# Altium project PCB_Project.PrjPcb (part 3 of 11)
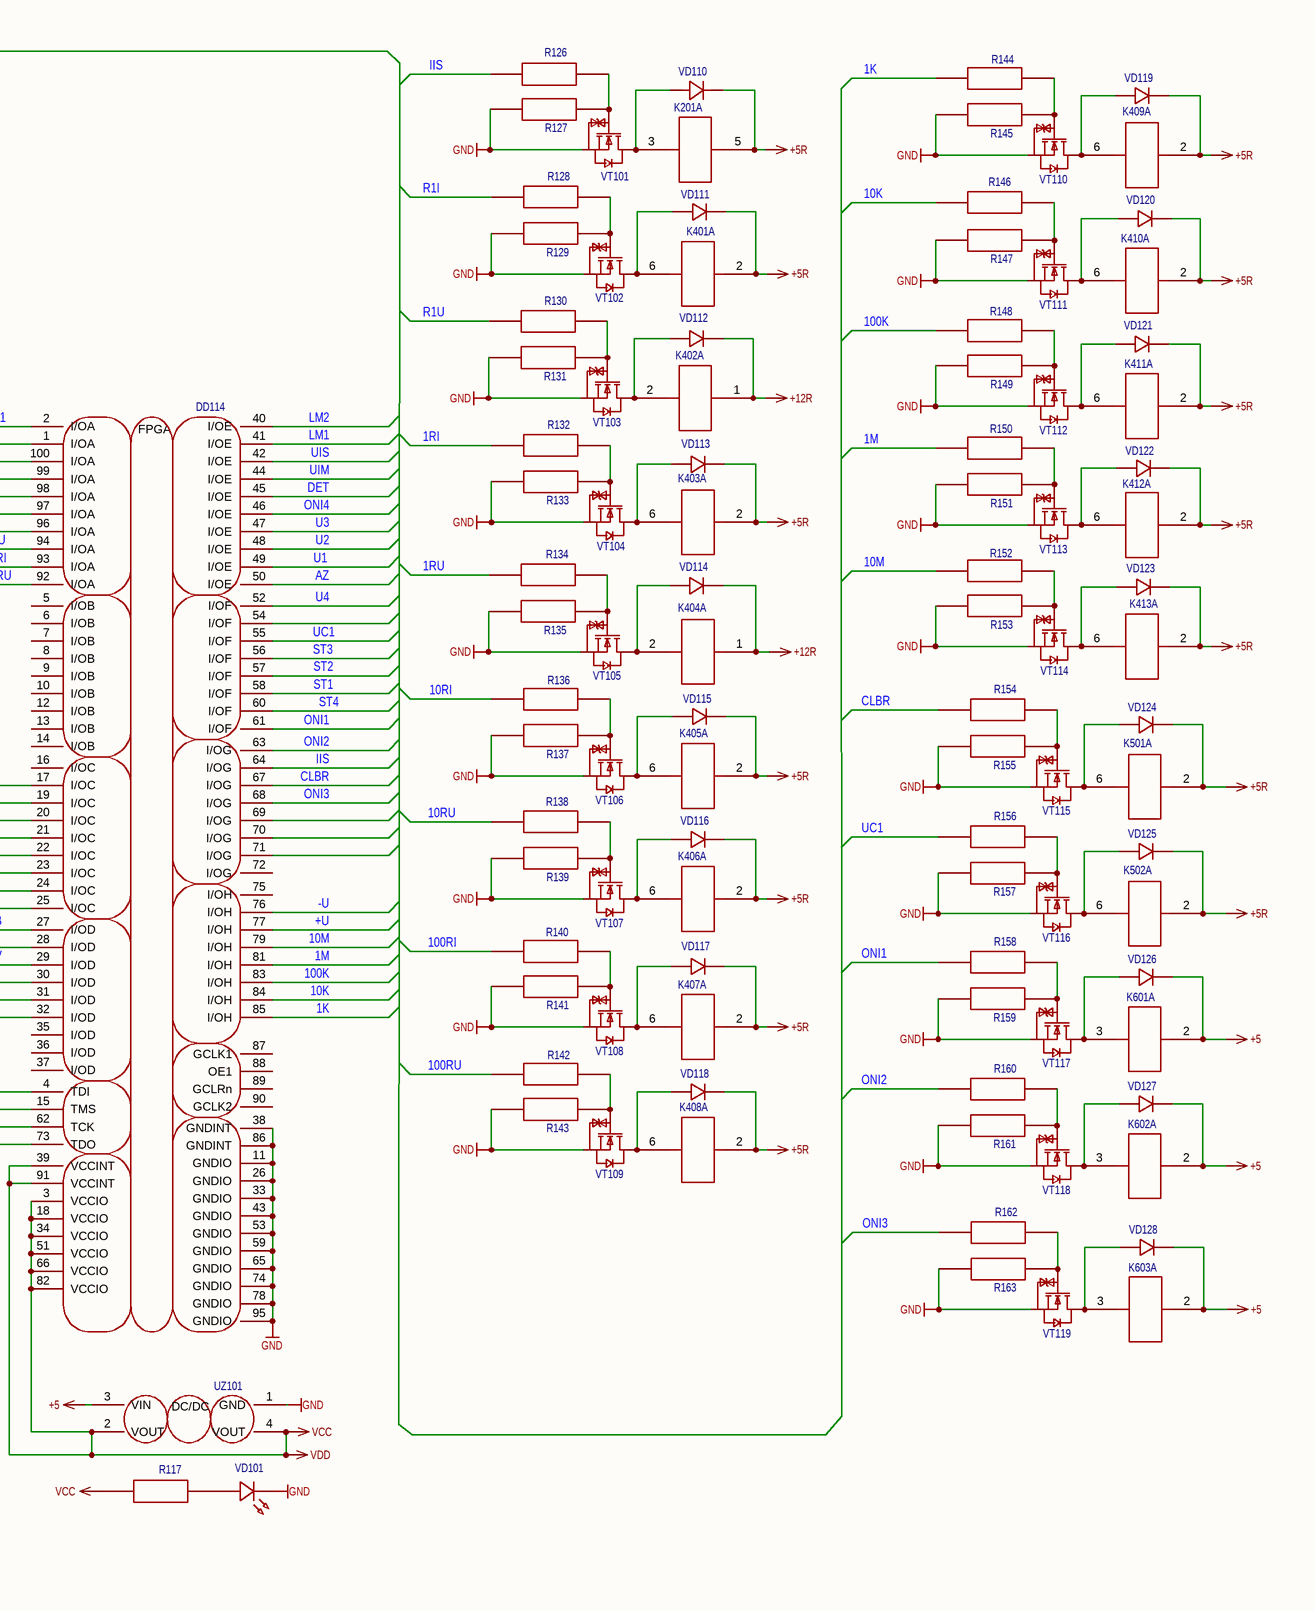
[diagram p9: УШЯИ.411618.029Э Э3 Лист 1.schdoc, right]

## Sheet УШЯИ.411618.029Э Э3 Лист 1.schdoc (continued)

### Library data of the parts (continued)
R143 = Резистор 100Ом 0,125Вт 1% [0805]: Contributor: jordanjin; Convert to PCB: yes; UniqueId: gge284a2cddc6cc5500; ModelId: de27d504f5024d53a3020ec2611f5e5e; Origin Footprint: R0805; Device: Резистор 100Ом 0,125Вт 1% [0805]; Symbol: Резистор 100Ом 0,125Вт 1% [0805]; Manufacturer Part: R0805; spicePre: R; spiceSymbolName: Резистор 12кОм 0,125Вт 1% [0805]; Add into BOM: yes; FootprintName: R0805; ModelName: R0805
R144 = Резистор 100Ом 0,125Вт 1% [DIP]: Origin Footprint: R0.125W; Contributor: jordanjin; Convert to PCB: yes; UniqueId: ggeaa410eb8306d9a98; Device: Резистор 100Ом 0,125Вт 1% [DIP]; Symbol: Резистор 100Ом 0,125Вт 1% [DIP]; Manufacturer Part: R0805; spicePre: R; spiceSymbolName: Резистор 100Ом 0,125Вт 1% [DIP]; Add into BOM: yes
R145 = Резистор 100Ом 0,125Вт 1% [0805]: Contributor: jordanjin; Convert to PCB: yes; UniqueId: gge17e49b262f8c481a; ModelId: de27d504f5024d53a3020ec2611f5e5e; Origin Footprint: R0805; Device: Резистор 100Ом 0,125Вт 1% [0805]; Symbol: Резистор 100Ом 0,125Вт 1% [0805]; Manufacturer Part: R0805; spicePre: R; spiceSymbolName: Резистор 12кОм 0,125Вт 1% [0805]; Add into BOM: yes; FootprintName: R0805; ModelName: R0805
R146 = Резистор 100Ом 0,125Вт 1% [DIP]: Origin Footprint: R0.125W; Contributor: jordanjin; Convert to PCB: yes; UniqueId: gge6c0c4eb072c61abf; Device: Резистор 100Ом 0,125Вт 1% [DIP]; Symbol: Резистор 100Ом 0,125Вт 1% [DIP]; Manufacturer Part: R0805; spicePre: R; spiceSymbolName: Резистор 100Ом 0,125Вт 1% [DIP]; Add into BOM: yes
R147 = Резистор 100Ом 0,125Вт 1% [0805]: Contributor: jordanjin; Convert to PCB: yes; UniqueId: ggeb272b0e92569094a; ModelId: de27d504f5024d53a3020ec2611f5e5e; Origin Footprint: R0805; Device: Резистор 100Ом 0,125Вт 1% [0805]; Symbol: Резистор 100Ом 0,125Вт 1% [0805]; Manufacturer Part: R0805; spicePre: R; spiceSymbolName: Резистор 12кОм 0,125Вт 1% [0805]; Add into BOM: yes; FootprintName: R0805; ModelName: R0805
R148 = Резистор 100Ом 0,125Вт 1% [DIP]: Origin Footprint: R0.125W; Contributor: jordanjin; Convert to PCB: yes; UniqueId: ggefae903f526e3c9e3; Device: Резистор 100Ом 0,125Вт 1% [DIP]; Symbol: Резистор 100Ом 0,125Вт 1% [DIP]; Manufacturer Part: R0805; spicePre: R; spiceSymbolName: Резистор 100Ом 0,125Вт 1% [DIP]; Add into BOM: yes
R149 = Резистор 100Ом 0,125Вт 1% [0805]: Contributor: jordanjin; Convert to PCB: yes; UniqueId: gge3dbaf11969537092; ModelId: de27d504f5024d53a3020ec2611f5e5e; Origin Footprint: R0805; Device: Резистор 100Ом 0,125Вт 1% [0805]; Symbol: Резистор 100Ом 0,125Вт 1% [0805]; Manufacturer Part: R0805; spicePre: R; spiceSymbolName: Резистор 12кОм 0,125Вт 1% [0805]; Add into BOM: yes; FootprintName: R0805; ModelName: R0805
R150 = Резистор 100Ом 0,125Вт 1% [DIP]: Origin Footprint: R0.125W; Contributor: jordanjin; Convert to PCB: yes; UniqueId: gge380871a5e186252d; Device: Резистор 100Ом 0,125Вт 1% [DIP]; Symbol: Резистор 100Ом 0,125Вт 1% [DIP]; Manufacturer Part: R0805; spicePre: R; spiceSymbolName: Резистор 100Ом 0,125Вт 1% [DIP]; Add into BOM: yes
R151 = Резистор 100Ом 0,125Вт 1% [0805]: Contributor: jordanjin; Convert to PCB: yes; UniqueId: gge063679ac9d12fccf; ModelId: de27d504f5024d53a3020ec2611f5e5e; Origin Footprint: R0805; Device: Резистор 100Ом 0,125Вт 1% [0805]; Symbol: Резистор 100Ом 0,125Вт 1% [0805]; Manufacturer Part: R0805; spicePre: R; spiceSymbolName: Резистор 12кОм 0,125Вт 1% [0805]; Add into BOM: yes; FootprintName: R0805; ModelName: R0805
R152 = Резистор 100Ом 0,125Вт 1% [DIP]: Origin Footprint: R0.125W; Contributor: jordanjin; Convert to PCB: yes; UniqueId: gge124f740b155750b2; Device: Резистор 100Ом 0,125Вт 1% [DIP]; Symbol: Резистор 100Ом 0,125Вт 1% [DIP]; Manufacturer Part: R0805; spicePre: R; spiceSymbolName: Резистор 100Ом 0,125Вт 1% [DIP]; Add into BOM: yes
R153 = Резистор 100Ом 0,125Вт 1% [0805]: Contributor: jordanjin; Convert to PCB: yes; UniqueId: gge27cee84ce076b68f; ModelId: de27d504f5024d53a3020ec2611f5e5e; Origin Footprint: R0805; Device: Резистор 100Ом 0,125Вт 1% [0805]; Symbol: Резистор 100Ом 0,125Вт 1% [0805]; Manufacturer Part: R0805; spicePre: R; spiceSymbolName: Резистор 12кОм 0,125Вт 1% [0805]; Add into BOM: yes; FootprintName: R0805; ModelName: R0805
R154 = Резистор 100Ом 0,125Вт 1% [DIP]: Origin Footprint: R0.125W; Contributor: jordanjin; Convert to PCB: yes; UniqueId: gge2e28954fc8669dd0; Device: Резистор 100Ом 0,125Вт 1% [DIP]; Symbol: Резистор 100Ом 0,125Вт 1% [DIP]; Manufacturer Part: R0805; spicePre: R; spiceSymbolName: Резистор 100Ом 0,125Вт 1% [DIP]; Add into BOM: yes
R155 = Резистор 100Ом 0,125Вт 1% [0805]: Contributor: jordanjin; Convert to PCB: yes; UniqueId: ggef886a17660e3a033; ModelId: de27d504f5024d53a3020ec2611f5e5e; Origin Footprint: R0805; Device: Резистор 100Ом 0,125Вт 1% [0805]; Symbol: Резистор 100Ом 0,125Вт 1% [0805]; Manufacturer Part: R0805; spicePre: R; spiceSymbolName: Резистор 12кОм 0,125Вт 1% [0805]; Add into BOM: yes; FootprintName: R0805; ModelName: R0805
R156 = Резистор 100Ом 0,125Вт 1% [DIP]: Origin Footprint: R0.125W; Contributor: jordanjin; Convert to PCB: yes; UniqueId: gge3cc4b2cca3c10891; Device: Резистор 100Ом 0,125Вт 1% [DIP]; Symbol: Резистор 100Ом 0,125Вт 1% [DIP]; Manufacturer Part: R0805; spicePre: R; spiceSymbolName: Резистор 100Ом 0,125Вт 1% [DIP]; Add into BOM: yes
R157 = Резистор 100Ом 0,125Вт 1% [0805]: Contributor: jordanjin; Convert to PCB: yes; UniqueId: gge7376950e8c8d98c9; ModelId: de27d504f5024d53a3020ec2611f5e5e; Origin Footprint: R0805; Device: Резистор 100Ом 0,125Вт 1% [0805]; Symbol: Резистор 100Ом 0,125Вт 1% [0805]; Manufacturer Part: R0805; spicePre: R; spiceSymbolName: Резистор 12кОм 0,125Вт 1% [0805]; Add into BOM: yes; FootprintName: R0805; ModelName: R0805
R158 = Резистор 100Ом 0,125Вт 1% [DIP]: Origin Footprint: R0.125W; Contributor: jordanjin; Convert to PCB: yes; UniqueId: gge4aba1a7132827d07; Device: Резистор 100Ом 0,125Вт 1% [DIP]; Symbol: Резистор 100Ом 0,125Вт 1% [DIP]; Manufacturer Part: R0805; spicePre: R; spiceSymbolName: Резистор 100Ом 0,125Вт 1% [DIP]; Add into BOM: yes
R159 = Резистор 100Ом 0,125Вт 1% [0805]: Contributor: jordanjin; Convert to PCB: yes; UniqueId: ggea32ed60242957927; ModelId: de27d504f5024d53a3020ec2611f5e5e; Origin Footprint: R0805; Device: Резистор 100Ом 0,125Вт 1% [0805]; Symbol: Резистор 100Ом 0,125Вт 1% [0805]; Manufacturer Part: R0805; spicePre: R; spiceSymbolName: Резистор 12кОм 0,125Вт 1% [0805]; Add into BOM: yes; FootprintName: R0805; ModelName: R0805
R160 R162 = Резистор 100Ом 0,125Вт 1% [DIP]: Origin Footprint: R0.125W; Contributor: jordanjin; Convert to PCB: yes; UniqueId: gge22a93cc7911c3764; Device: Резистор 100Ом 0,125Вт 1% [DIP]; Symbol: Резистор 100Ом 0,125Вт 1% [DIP]; Manufacturer Part: R0805; spicePre: R; spiceSymbolName: Резистор 100Ом 0,125Вт 1% [DIP]; Add into BOM: yes
R161 R163 = Резистор 100Ом 0,125Вт 1% [0805]: Contributor: jordanjin; Convert to PCB: yes; UniqueId: ggef701d6db619cb508; ModelId: de27d504f5024d53a3020ec2611f5e5e; Origin Footprint: R0805; Device: Резистор 100Ом 0,125Вт 1% [0805]; Symbol: Резистор 100Ом 0,125Вт 1% [0805]; Manufacturer Part: R0805; spicePre: R; spiceSymbolName: Резистор 12кОм 0,125Вт 1% [0805]; Add into BOM: yes; FootprintName: R0805; ModelName: R0805
UZ101 = Линейный регулятор напряжения LM1117GS-3.3 [SOT-223]: Manufacturer: HTC; Contributor: jordanjin; Convert to PCB: yes; UniqueId: ggebbc6c2b0414b7192; Origin Footprint: SOT-223-3_L6.5-W3.4-P2.30-LS7.0-BR; Device: Линейный регулятор напряжения LM1117GS-3.3 [SOT-223]; Symbol: Линейный регулятор напряжения LM1117GS-3.3 [SOT-223]; Supplier: LCSC; Supplier Part: C411821; Manufacturer Part: LM1117GS-3.3; JLCPCB Part Class: Extended Part; spicePre: U; spiceSymbolName: Линейный регулятор напряжения LM1117GS-3.3 [SOT-223]; Add into BOM: yes; FootprintName: SOT-223-3_L6.5-W3.4-P2.30-LS7.0-BR
VD101 = Светодиод YLED0805YG [0805]: Manufacturer: YONGYUTAI(永裕泰); Contributor: lcsc; Convert to PCB: yes; UniqueId: gge55c891089defb0cc; Origin Footprint: LED0805-R-RD; Device: Светодиод YLED0805YG [0805]; Symbol: Светодиод YLED0805YG [0805]; Supplier: LCSC; Supplier Part: C19171393; Manufacturer Part: YLED0805YG; JLCPCB Part Class: Extended Part; spicePre: U; spiceSymbolName: YLED0805YG; Add into BOM: yes; FootprintName: LED0805-R-RD
VD102 = Светодиод FYLS-0805GC [0805]: Manufacturer: Ningbo Foryard Optoelectronics; Contributor: jordanjin; Convert to PCB: yes; UniqueId: ggeb9dbbd666b622848; Origin Footprint: FYLS-0805GC; Device: Светодиод FYLS-0805GC [0805]; Symbol: Светодиод FYLS-0805GC [0805]; Manufacturer Part: FYLS-0805GC; spicePre: V; spiceSymbolName: FYLS-0805GC; Add into BOM: yes
VD103 = Светодиод FYLS-0805GC [0805]: Manufacturer: Ningbo Foryard Optoelectronics; Contributor: jordanjin; Convert to PCB: yes; UniqueId: ggedbf1e97d50b40f59; Origin Footprint: FYLS-0805GC; Device: Светодиод FYLS-0805GC [0805]; Symbol: Светодиод FYLS-0805GC [0805]; Manufacturer Part: FYLS-0805GC; spicePre: V; spiceSymbolName: FYLS-0805GC; Add into BOM: yes
VD104 = Светодиод FYLS-0805GC [0805]: Manufacturer: Ningbo Foryard Optoelectronics; Contributor: jordanjin; Convert to PCB: yes; UniqueId: ggefd7f9cc88ba5af29; Origin Footprint: FYLS-0805GC; Device: Светодиод FYLS-0805GC [0805]; Symbol: Светодиод FYLS-0805GC [0805]; Manufacturer Part: FYLS-0805GC; spicePre: V; spiceSymbolName: FYLS-0805GC; Add into BOM: yes
VD105 = Светодиод FYLS-0805GC [0805]: Manufacturer: Ningbo Foryard Optoelectronics; Contributor: jordanjin; Convert to PCB: yes; UniqueId: gge69c4a475fa0f9d21; Origin Footprint: FYLS-0805GC; Device: Светодиод FYLS-0805GC [0805]; Symbol: Светодиод FYLS-0805GC [0805]; Manufacturer Part: FYLS-0805GC; spicePre: V; spiceSymbolName: FYLS-0805GC; Add into BOM: yes
VD106 = Светодиод FYLS-0805GC [0805]: Manufacturer: Ningbo Foryard Optoelectronics; Contributor: jordanjin; Convert to PCB: yes; UniqueId: gge2459f9207d57712e; Origin Footprint: FYLS-0805GC; Device: Светодиод FYLS-0805GC [0805]; Symbol: Светодиод FYLS-0805GC [0805]; Manufacturer Part: FYLS-0805GC; spicePre: V; spiceSymbolName: FYLS-0805GC; Add into BOM: yes
VD107 = Светодиод FYLS-0805GC [0805]: Manufacturer: Ningbo Foryard Optoelectronics; Contributor: jordanjin; Convert to PCB: yes; UniqueId: gge76ae14a4fa315c80; Origin Footprint: FYLS-0805GC; Device: Светодиод FYLS-0805GC [0805]; Symbol: Светодиод FYLS-0805GC [0805]; Manufacturer Part: FYLS-0805GC; spicePre: V; spiceSymbolName: FYLS-0805GC; Add into BOM: yes
VD108 = Светодиод FYLS-0805GC [0805]: Manufacturer: Ningbo Foryard Optoelectronics; Contributor: jordanjin; Convert to PCB: yes; UniqueId: gge23dfa43ba5af9ad1; Origin Footprint: FYLS-0805GC; Device: Светодиод FYLS-0805GC [0805]; Symbol: Светодиод FYLS-0805GC [0805]; Manufacturer Part: FYLS-0805GC; spicePre: V; spiceSymbolName: FYLS-0805GC; Add into BOM: yes
VD109 = Светодиод FYLS-0805GC [0805]: Manufacturer: Ningbo Foryard Optoelectronics; Contributor: jordanjin; Convert to PCB: yes; UniqueId: ggefc489dcc3785d6cb; Origin Footprint: FYLS-0805GC; Device: Светодиод FYLS-0805GC [0805]; Symbol: Светодиод FYLS-0805GC [0805]; Manufacturer Part: FYLS-0805GC; spicePre: V; spiceSymbolName: FYLS-0805GC; Add into BOM: yes
VD110 = Диод импульсный 1N4448 [SOD-123]: Manufacturer: YANGJIE; Manufacturer Part: 1N4448WQ; Contributor: jordanjin; Convert to PCB: yes; UniqueId: gge7db06b9b0cd09909; ModelId: 5a61cd31046d4447ba73169a45a0935b; Origin Footprint: SOD-123_L2.7-W1.6-LS3.7-RD-1; Device: Диод импульсный 1N4448 [SOD-123]; Symbol: Диод импульсный 1N4448 [SOD-123]; Supplier: LCSC; JLCPCB Part Class: Extended Part; spicePre: V; spiceSymbolName: Диод импульсный 1N4448 [SOD-123]; Add into BOM: yes; FootprintName: SOD-123_L2.7-W1.6-LS3.7-RD-1; ModelName: SOD-123_L2.7-W1.6-LS3.7-RD-1
VD111 = Диод импульсный 1N4448 [DO-35]: Manufacturer: onsemi; Manufacturer Part: 1N4448TR; Contributor: jordanjin; Convert to PCB: yes; UniqueId: gge1dc3ee198911c888; Origin Footprint: DO-35_BD2.0-L4.2-P8.20-D0.5-RD; Device: Диод импульсный 1N4448 [DO-35]; Symbol: Диод импульсный 1N4448 [DO-35]; Supplier: LCSC; JLCPCB Part Class: Extended Part; spicePre: V; spiceSymbolName: Диод импульсный 1N4448 [DO-35]; Add into BOM: yes; FootprintName: DO-35_BD2.0-L4.2-P8.20-D0.5-RD
VD112 = Диод импульсный 1N4448 [DO-35]: Manufacturer: onsemi; Manufacturer Part: 1N4448TR; Contributor: jordanjin; Convert to PCB: yes; UniqueId: gge9ea33a3634705890; Origin Footprint: DO-35_BD2.0-L4.2-P8.20-D0.5-RD; Device: Диод импульсный 1N4448 [DO-35]; Symbol: Диод импульсный 1N4448 [DO-35]; Supplier: LCSC; JLCPCB Part Class: Extended Part; spicePre: V; spiceSymbolName: Диод импульсный 1N4448 [DO-35]; Add into BOM: yes; FootprintName: DO-35_BD2.0-L4.2-P8.20-D0.5-RD
VD113 = Диод импульсный 1N4448 [DO-35]: Manufacturer: onsemi; Manufacturer Part: 1N4448TR; Contributor: jordanjin; Convert to PCB: yes; UniqueId: gge0b98b54c202bc52f; Origin Footprint: DO-35_BD2.0-L4.2-P8.20-D0.5-RD; Device: Диод импульсный 1N4448 [DO-35]; Symbol: Диод импульсный 1N4448 [DO-35]; Supplier: LCSC; JLCPCB Part Class: Extended Part; spicePre: V; spiceSymbolName: Диод импульсный 1N4448 [DO-35]; Add into BOM: yes; FootprintName: DO-35_BD2.0-L4.2-P8.20-D0.5-RD
VD114 = Диод импульсный 1N4448 [DO-35]: Manufacturer: onsemi; Manufacturer Part: 1N4448TR; Contributor: jordanjin; Convert to PCB: yes; UniqueId: ggec00ae156fd4c9668; Origin Footprint: DO-35_BD2.0-L4.2-P8.20-D0.5-RD; Device: Диод импульсный 1N4448 [DO-35]; Symbol: Диод импульсный 1N4448 [DO-35]; Supplier: LCSC; JLCPCB Part Class: Extended Part; spicePre: V; spiceSymbolName: Диод импульсный 1N4448 [DO-35]; Add into BOM: yes; FootprintName: DO-35_BD2.0-L4.2-P8.20-D0.5-RD
VD115 = Диод импульсный 1N4448 [DO-35]: Manufacturer: onsemi; Manufacturer Part: 1N4448TR; Contributor: jordanjin; Convert to PCB: yes; UniqueId: gged02e77e36bdff4e4; Origin Footprint: DO-35_BD2.0-L4.2-P8.20-D0.5-RD; Device: Диод импульсный 1N4448 [DO-35]; Symbol: Диод импульсный 1N4448 [DO-35]; Supplier: LCSC; JLCPCB Part Class: Extended Part; spicePre: V; spiceSymbolName: Диод импульсный 1N4448 [DO-35]; Add into BOM: yes; FootprintName: DO-35_BD2.0-L4.2-P8.20-D0.5-RD
VD116 = Диод импульсный 1N4448 [DO-35]: Manufacturer: onsemi; Manufacturer Part: 1N4448TR; Contributor: jordanjin; Convert to PCB: yes; UniqueId: gge7fab4cb7727db103; Origin Footprint: DO-35_BD2.0-L4.2-P8.20-D0.5-RD; Device: Диод импульсный 1N4448 [DO-35]; Symbol: Диод импульсный 1N4448 [DO-35]; Supplier: LCSC; JLCPCB Part Class: Extended Part; spicePre: V; spiceSymbolName: Диод импульсный 1N4448 [DO-35]; Add into BOM: yes; FootprintName: DO-35_BD2.0-L4.2-P8.20-D0.5-RD
VD117 = Диод импульсный 1N4448 [DO-35]: Manufacturer: onsemi; Manufacturer Part: 1N4448TR; Contributor: jordanjin; Convert to PCB: yes; UniqueId: gged1927a800476600c; Origin Footprint: DO-35_BD2.0-L4.2-P8.20-D0.5-RD; Device: Диод импульсный 1N4448 [DO-35]; Symbol: Диод импульсный 1N4448 [DO-35]; Supplier: LCSC; JLCPCB Part Class: Extended Part; spicePre: V; spiceSymbolName: Диод импульсный 1N4448 [DO-35]; Add into BOM: yes; FootprintName: DO-35_BD2.0-L4.2-P8.20-D0.5-RD
VD118 = Диод импульсный 1N4448 [DO-35]: Manufacturer: onsemi; Manufacturer Part: 1N4448TR; Contributor: jordanjin; Convert to PCB: yes; UniqueId: gge147911214a790f5a; Origin Footprint: DO-35_BD2.0-L4.2-P8.20-D0.5-RD; Device: Диод импульсный 1N4448 [DO-35]; Symbol: Диод импульсный 1N4448 [DO-35]; Supplier: LCSC; JLCPCB Part Class: Extended Part; spicePre: V; spiceSymbolName: Диод импульсный 1N4448 [DO-35]; Add into BOM: yes; FootprintName: DO-35_BD2.0-L4.2-P8.20-D0.5-RD
VD119 = Диод импульсный 1N4448 [DO-35]: Manufacturer: onsemi; Manufacturer Part: 1N4448TR; Contributor: jordanjin; Convert to PCB: yes; UniqueId: gge450b94f6d14b21bf; Origin Footprint: DO-35_BD2.0-L4.2-P8.20-D0.5-RD; Device: Диод импульсный 1N4448 [DO-35]; Symbol: Диод импульсный 1N4448 [DO-35]; Supplier: LCSC; JLCPCB Part Class: Extended Part; spicePre: V; spiceSymbolName: Диод импульсный 1N4448 [DO-35]; Add into BOM: yes; FootprintName: DO-35_BD2.0-L4.2-P8.20-D0.5-RD
VD120 = Диод импульсный 1N4448 [DO-35]: Manufacturer: onsemi; Manufacturer Part: 1N4448TR; Contributor: jordanjin; Convert to PCB: yes; UniqueId: gge3179cf16cbfb44c0; Origin Footprint: DO-35_BD2.0-L4.2-P8.20-D0.5-RD; Device: Диод импульсный 1N4448 [DO-35]; Symbol: Диод импульсный 1N4448 [DO-35]; Supplier: LCSC; JLCPCB Part Class: Extended Part; spicePre: V; spiceSymbolName: Диод импульсный 1N4448 [DO-35]; Add into BOM: yes; FootprintName: DO-35_BD2.0-L4.2-P8.20-D0.5-RD
VD121 = Диод импульсный 1N4448 [DO-35]: Manufacturer: onsemi; Manufacturer Part: 1N4448TR; Contributor: jordanjin; Convert to PCB: yes; UniqueId: gge16bafdcd8773b3af; Origin Footprint: DO-35_BD2.0-L4.2-P8.20-D0.5-RD; Device: Диод импульсный 1N4448 [DO-35]; Symbol: Диод импульсный 1N4448 [DO-35]; Supplier: LCSC; JLCPCB Part Class: Extended Part; spicePre: V; spiceSymbolName: Диод импульсный 1N4448 [DO-35]; Add into BOM: yes; FootprintName: DO-35_BD2.0-L4.2-P8.20-D0.5-RD
VD122 = Диод импульсный 1N4448 [DO-35]: Manufacturer: onsemi; Manufacturer Part: 1N4448TR; Contributor: jordanjin; Convert to PCB: yes; UniqueId: ggea08182b92e7ac852; Origin Footprint: DO-35_BD2.0-L4.2-P8.20-D0.5-RD; Device: Диод импульсный 1N4448 [DO-35]; Symbol: Диод импульсный 1N4448 [DO-35]; Supplier: LCSC; JLCPCB Part Class: Extended Part; spicePre: V; spiceSymbolName: Диод импульсный 1N4448 [DO-35]; Add into BOM: yes; FootprintName: DO-35_BD2.0-L4.2-P8.20-D0.5-RD
VD123 = Диод импульсный 1N4448 [DO-35]: Manufacturer: onsemi; Manufacturer Part: 1N4448TR; Contributor: jordanjin; Convert to PCB: yes; UniqueId: gge25a9f0d4d20149e0; Origin Footprint: DO-35_BD2.0-L4.2-P8.20-D0.5-RD; Device: Диод импульсный 1N4448 [DO-35]; Symbol: Диод импульсный 1N4448 [DO-35]; Supplier: LCSC; JLCPCB Part Class: Extended Part; spicePre: V; spiceSymbolName: Диод импульсный 1N4448 [DO-35]; Add into BOM: yes; FootprintName: DO-35_BD2.0-L4.2-P8.20-D0.5-RD
VD124 = Диод импульсный 1N4448 [DO-35]: Manufacturer: onsemi; Manufacturer Part: 1N4448TR; Contributor: jordanjin; Convert to PCB: yes; UniqueId: gge16fe8a640c6a618d; Origin Footprint: DO-35_BD2.0-L4.2-P8.20-D0.5-RD; Device: Диод импульсный 1N4448 [DO-35]; Symbol: Диод импульсный 1N4448 [DO-35]; Supplier: LCSC; JLCPCB Part Class: Extended Part; spicePre: V; spiceSymbolName: Диод импульсный 1N4448 [DO-35]; Add into BOM: yes; FootprintName: DO-35_BD2.0-L4.2-P8.20-D0.5-RD
VD125 = Диод импульсный 1N4448 [DO-35]: Manufacturer: onsemi; Manufacturer Part: 1N4448TR; Contributor: jordanjin; Convert to PCB: yes; UniqueId: gge541582f0119c4d36; Origin Footprint: DO-35_BD2.0-L4.2-P8.20-D0.5-RD; Device: Диод импульсный 1N4448 [DO-35]; Symbol: Диод импульсный 1N4448 [DO-35]; Supplier: LCSC; JLCPCB Part Class: Extended Part; spicePre: V; spiceSymbolName: Диод импульсный 1N4448 [DO-35]; Add into BOM: yes; FootprintName: DO-35_BD2.0-L4.2-P8.20-D0.5-RD
VD126 = Диод импульсный 1N4448 [DO-35]: Manufacturer: onsemi; Manufacturer Part: 1N4448TR; Contributor: jordanjin; Convert to PCB: yes; UniqueId: ggeee7252bc2dd23639; Origin Footprint: DO-35_BD2.0-L4.2-P8.20-D0.5-RD; Device: Диод импульсный 1N4448 [DO-35]; Symbol: Диод импульсный 1N4448 [DO-35]; Supplier: LCSC; JLCPCB Part Class: Extended Part; spicePre: V; spiceSymbolName: Диод импульсный 1N4448 [DO-35]; Add into BOM: yes; FootprintName: DO-35_BD2.0-L4.2-P8.20-D0.5-RD
VD127 VD128 = Диод импульсный 1N4448 [DO-35]: Manufacturer: onsemi; Manufacturer Part: 1N4448TR; Contributor: jordanjin; Convert to PCB: yes; UniqueId: gge246488279c87fbb7; Origin Footprint: DO-35_BD2.0-L4.2-P8.20-D0.5-RD; Device: Диод импульсный 1N4448 [DO-35]; Symbol: Диод импульсный 1N4448 [DO-35]; Supplier: LCSC; JLCPCB Part Class: Extended Part; spicePre: V; spiceSymbolName: Диод импульсный 1N4448 [DO-35]; Add into BOM: yes; FootprintName: DO-35_BD2.0-L4.2-P8.20-D0.5-RD
VT101 = Транзистор полевой MOSFET N-канальный BSS138BK [SOT-23-3]: Manufacturer: ElecSuper(静芯); Contributor: lcsc; Convert to PCB: yes; UniqueId: gge8792bcff5f0cbe56; Origin Footprint: SOT-23-3_L2.9-W1.3-P1.90-LS2.4-BR; Device: Транзистор полевой MOSFET N-канальный BSS138BK [SOT-23-3]; Symbol: Транзистор полевой MOSFET N-канальный BSS138BK [SOT-23-3]; Supplier: LCSC; Supplier Part: C5224267; Manufacturer Part: BSS138BK; JLCPCB Part Class: Extended Part; spicePre: Q; spiceSymbolName: BSS138BK; Add into BOM: yes; FootprintName: SOT-23-3_L2.9-W1.3-P1.90-LS2.4-BR
VT102 = Транзистор полевой MOSFET N-канальный BSS138BK [SOT-23-3]: Manufacturer: ElecSuper(静芯); Contributor: lcsc; Convert to PCB: yes; UniqueId: ggea0371602905d5c15; Origin Footprint: SOT-23-3_L2.9-W1.3-P1.90-LS2.4-BR; Device: Транзистор полевой MOSFET N-канальный BSS138BK [SOT-23-3]; Symbol: Транзистор полевой MOSFET N-канальный BSS138BK [SOT-23-3]; Supplier: LCSC; Supplier Part: C5224267; Manufacturer Part: BSS138BK; JLCPCB Part Class: Extended Part; spicePre: Q; spiceSymbolName: BSS138BK; Add into BOM: yes; FootprintName: SOT-23-3_L2.9-W1.3-P1.90-LS2.4-BR
VT103 = Транзистор полевой MOSFET N-канальный BSS138BK [SOT-23-3]: Manufacturer: ElecSuper(静芯); Contributor: lcsc; Convert to PCB: yes; UniqueId: gge1429afdf2c585460; Origin Footprint: SOT-23-3_L2.9-W1.3-P1.90-LS2.4-BR; Device: Транзистор полевой MOSFET N-канальный BSS138BK [SOT-23-3]; Symbol: Транзистор полевой MOSFET N-канальный BSS138BK [SOT-23-3]; Supplier: LCSC; Supplier Part: C5224267; Manufacturer Part: BSS138BK; JLCPCB Part Class: Extended Part; spicePre: Q; spiceSymbolName: BSS138BK; Add into BOM: yes; FootprintName: SOT-23-3_L2.9-W1.3-P1.90-LS2.4-BR
VT104 = Транзистор полевой MOSFET N-канальный BSS138BK [SOT-23-3]: Manufacturer: ElecSuper(静芯); Contributor: lcsc; Convert to PCB: yes; UniqueId: ggeb864250f3607abc7; Origin Footprint: SOT-23-3_L2.9-W1.3-P1.90-LS2.4-BR; Device: Транзистор полевой MOSFET N-канальный BSS138BK [SOT-23-3]; Symbol: Транзистор полевой MOSFET N-канальный BSS138BK [SOT-23-3]; Supplier: LCSC; Supplier Part: C5224267; Manufacturer Part: BSS138BK; JLCPCB Part Class: Extended Part; spicePre: Q; spiceSymbolName: BSS138BK; Add into BOM: yes; FootprintName: SOT-23-3_L2.9-W1.3-P1.90-LS2.4-BR
VT105 = Транзистор полевой MOSFET N-канальный BSS138BK [SOT-23-3]: Manufacturer: ElecSuper(静芯); Contributor: lcsc; Convert to PCB: yes; UniqueId: ggedee92230c75ee414; Origin Footprint: SOT-23-3_L2.9-W1.3-P1.90-LS2.4-BR; Device: Транзистор полевой MOSFET N-канальный BSS138BK [SOT-23-3]; Symbol: Транзистор полевой MOSFET N-канальный BSS138BK [SOT-23-3]; Supplier: LCSC; Supplier Part: C5224267; Manufacturer Part: BSS138BK; JLCPCB Part Class: Extended Part; spicePre: Q; spiceSymbolName: BSS138BK; Add into BOM: yes; FootprintName: SOT-23-3_L2.9-W1.3-P1.90-LS2.4-BR
VT106 = Транзистор полевой MOSFET N-канальный BSS138BK [SOT-23-3]: Manufacturer: ElecSuper(静芯); Contributor: lcsc; Convert to PCB: yes; UniqueId: gge8cb31266a5655e02; Origin Footprint: SOT-23-3_L2.9-W1.3-P1.90-LS2.4-BR; Device: Транзистор полевой MOSFET N-канальный BSS138BK [SOT-23-3]; Symbol: Транзистор полевой MOSFET N-канальный BSS138BK [SOT-23-3]; Supplier: LCSC; Supplier Part: C5224267; Manufacturer Part: BSS138BK; JLCPCB Part Class: Extended Part; spicePre: Q; spiceSymbolName: BSS138BK; Add into BOM: yes; FootprintName: SOT-23-3_L2.9-W1.3-P1.90-LS2.4-BR
VT107 = Транзистор полевой MOSFET N-канальный BSS138BK [SOT-23-3]: Manufacturer: ElecSuper(静芯); Contributor: lcsc; Convert to PCB: yes; UniqueId: ggeb5b1c9e11f94c9a1; Origin Footprint: SOT-23-3_L2.9-W1.3-P1.90-LS2.4-BR; Device: Транзистор полевой MOSFET N-канальный BSS138BK [SOT-23-3]; Symbol: Транзистор полевой MOSFET N-канальный BSS138BK [SOT-23-3]; Supplier: LCSC; Supplier Part: C5224267; Manufacturer Part: BSS138BK; JLCPCB Part Class: Extended Part; spicePre: Q; spiceSymbolName: BSS138BK; Add into BOM: yes; FootprintName: SOT-23-3_L2.9-W1.3-P1.90-LS2.4-BR
VT108 = Транзистор полевой MOSFET N-канальный BSS138BK [SOT-23-3]: Manufacturer: ElecSuper(静芯); Contributor: lcsc; Convert to PCB: yes; UniqueId: gge236253568f683054; Origin Footprint: SOT-23-3_L2.9-W1.3-P1.90-LS2.4-BR; Device: Транзистор полевой MOSFET N-канальный BSS138BK [SOT-23-3]; Symbol: Транзистор полевой MOSFET N-канальный BSS138BK [SOT-23-3]; Supplier: LCSC; Supplier Part: C5224267; Manufacturer Part: BSS138BK; JLCPCB Part Class: Extended Part; spicePre: Q; spiceSymbolName: BSS138BK; Add into BOM: yes; FootprintName: SOT-23-3_L2.9-W1.3-P1.90-LS2.4-BR
VT109 = Транзистор полевой MOSFET N-канальный BSS138BK [SOT-23-3]: Manufacturer: ElecSuper(静芯); Contributor: lcsc; Convert to PCB: yes; UniqueId: ggeea7b5d05107eec70; Origin Footprint: SOT-23-3_L2.9-W1.3-P1.90-LS2.4-BR; Device: Транзистор полевой MOSFET N-канальный BSS138BK [SOT-23-3]; Symbol: Транзистор полевой MOSFET N-канальный BSS138BK [SOT-23-3]; Supplier: LCSC; Supplier Part: C5224267; Manufacturer Part: BSS138BK; JLCPCB Part Class: Extended Part; spicePre: Q; spiceSymbolName: BSS138BK; Add into BOM: yes; FootprintName: SOT-23-3_L2.9-W1.3-P1.90-LS2.4-BR
VT110 = Транзистор полевой MOSFET N-канальный BSS138BK [SOT-23-3]: Manufacturer: ElecSuper(静芯); Contributor: lcsc; Convert to PCB: yes; UniqueId: gge60e6376a72c64a45; Origin Footprint: SOT-23-3_L2.9-W1.3-P1.90-LS2.4-BR; Device: Транзистор полевой MOSFET N-канальный BSS138BK [SOT-23-3]; Symbol: Транзистор полевой MOSFET N-канальный BSS138BK [SOT-23-3]; Supplier: LCSC; Supplier Part: C5224267; Manufacturer Part: BSS138BK; JLCPCB Part Class: Extended Part; spicePre: Q; spiceSymbolName: BSS138BK; Add into BOM: yes; FootprintName: SOT-23-3_L2.9-W1.3-P1.90-LS2.4-BR
VT111 = Транзистор полевой MOSFET N-канальный BSS138BK [SOT-23-3]: Manufacturer: ElecSuper(静芯); Contributor: lcsc; Convert to PCB: yes; UniqueId: ggea5da7f6312e7299f; Origin Footprint: SOT-23-3_L2.9-W1.3-P1.90-LS2.4-BR; Device: Транзистор полевой MOSFET N-канальный BSS138BK [SOT-23-3]; Symbol: Транзистор полевой MOSFET N-канальный BSS138BK [SOT-23-3]; Supplier: LCSC; Supplier Part: C5224267; Manufacturer Part: BSS138BK; JLCPCB Part Class: Extended Part; spicePre: Q; spiceSymbolName: BSS138BK; Add into BOM: yes; FootprintName: SOT-23-3_L2.9-W1.3-P1.90-LS2.4-BR
VT112 = Транзистор полевой MOSFET N-канальный BSS138BK [SOT-23-3]: Manufacturer: ElecSuper(静芯); Contributor: lcsc; Convert to PCB: yes; UniqueId: gge1dc89095c85386c3; Origin Footprint: SOT-23-3_L2.9-W1.3-P1.90-LS2.4-BR; Device: Транзистор полевой MOSFET N-канальный BSS138BK [SOT-23-3]; Symbol: Транзистор полевой MOSFET N-канальный BSS138BK [SOT-23-3]; Supplier: LCSC; Supplier Part: C5224267; Manufacturer Part: BSS138BK; JLCPCB Part Class: Extended Part; spicePre: Q; spiceSymbolName: BSS138BK; Add into BOM: yes; FootprintName: SOT-23-3_L2.9-W1.3-P1.90-LS2.4-BR
VT113 = Транзистор полевой MOSFET N-канальный BSS138BK [SOT-23-3]: Manufacturer: ElecSuper(静芯); Contributor: lcsc; Convert to PCB: yes; UniqueId: gge030e1253f0ceda81; Origin Footprint: SOT-23-3_L2.9-W1.3-P1.90-LS2.4-BR; Device: Транзистор полевой MOSFET N-канальный BSS138BK [SOT-23-3]; Symbol: Транзистор полевой MOSFET N-канальный BSS138BK [SOT-23-3]; Supplier: LCSC; Supplier Part: C5224267; Manufacturer Part: BSS138BK; JLCPCB Part Class: Extended Part; spicePre: Q; spiceSymbolName: BSS138BK; Add into BOM: yes; FootprintName: SOT-23-3_L2.9-W1.3-P1.90-LS2.4-BR
VT114 = Транзистор полевой MOSFET N-канальный BSS138BK [SOT-23-3]: Manufacturer: ElecSuper(静芯); Contributor: lcsc; Convert to PCB: yes; UniqueId: gge129fd8e6a3a1c7e7; Origin Footprint: SOT-23-3_L2.9-W1.3-P1.90-LS2.4-BR; Device: Транзистор полевой MOSFET N-канальный BSS138BK [SOT-23-3]; Symbol: Транзистор полевой MOSFET N-канальный BSS138BK [SOT-23-3]; Supplier: LCSC; Supplier Part: C5224267; Manufacturer Part: BSS138BK; JLCPCB Part Class: Extended Part; spicePre: Q; spiceSymbolName: BSS138BK; Add into BOM: yes; FootprintName: SOT-23-3_L2.9-W1.3-P1.90-LS2.4-BR
VT115 = Транзистор полевой MOSFET N-канальный BSS138BK [SOT-23-3]: Manufacturer: ElecSuper(静芯); Contributor: lcsc; Convert to PCB: yes; UniqueId: ggef40e84c15a2b61ae; Origin Footprint: SOT-23-3_L2.9-W1.3-P1.90-LS2.4-BR; Device: Транзистор полевой MOSFET N-канальный BSS138BK [SOT-23-3]; Symbol: Транзистор полевой MOSFET N-канальный BSS138BK [SOT-23-3]; Supplier: LCSC; Supplier Part: C5224267; Manufacturer Part: BSS138BK; JLCPCB Part Class: Extended Part; spicePre: Q; spiceSymbolName: BSS138BK; Add into BOM: yes; FootprintName: SOT-23-3_L2.9-W1.3-P1.90-LS2.4-BR
VT116 = Транзистор полевой MOSFET N-канальный BSS138BK [SOT-23-3]: Manufacturer: ElecSuper(静芯); Contributor: lcsc; Convert to PCB: yes; UniqueId: gge96b2b732c9f4f151; Origin Footprint: SOT-23-3_L2.9-W1.3-P1.90-LS2.4-BR; Device: Транзистор полевой MOSFET N-канальный BSS138BK [SOT-23-3]; Symbol: Транзистор полевой MOSFET N-канальный BSS138BK [SOT-23-3]; Supplier: LCSC; Supplier Part: C5224267; Manufacturer Part: BSS138BK; JLCPCB Part Class: Extended Part; spicePre: Q; spiceSymbolName: BSS138BK; Add into BOM: yes; FootprintName: SOT-23-3_L2.9-W1.3-P1.90-LS2.4-BR
VT117 = Транзистор полевой MOSFET N-канальный BSS138BK [SOT-23-3]: Manufacturer: ElecSuper(静芯); Contributor: lcsc; Convert to PCB: yes; UniqueId: gge4df12748e8334087; Origin Footprint: SOT-23-3_L2.9-W1.3-P1.90-LS2.4-BR; Device: Транзистор полевой MOSFET N-канальный BSS138BK [SOT-23-3]; Symbol: Транзистор полевой MOSFET N-канальный BSS138BK [SOT-23-3]; Supplier: LCSC; Supplier Part: C5224267; Manufacturer Part: BSS138BK; JLCPCB Part Class: Extended Part; spicePre: Q; spiceSymbolName: BSS138BK; Add into BOM: yes; FootprintName: SOT-23-3_L2.9-W1.3-P1.90-LS2.4-BR
VT118 VT119 = Транзистор полевой MOSFET N-канальный BSS138BK [SOT-23-3]: Manufacturer: ElecSuper(静芯); Contributor: lcsc; Convert to PCB: yes; UniqueId: ggee4b5e09a670cbf37; Origin Footprint: SOT-23-3_L2.9-W1.3-P1.90-LS2.4-BR; Device: Транзистор полевой MOSFET N-канальный BSS138BK [SOT-23-3]; Symbol: Транзистор полевой MOSFET N-канальный BSS138BK [SOT-23-3]; Supplier: LCSC; Supplier Part: C5224267; Manufacturer Part: BSS138BK; JLCPCB Part Class: Extended Part; spicePre: Q; spiceSymbolName: BSS138BK; Add into BOM: yes; FootprintName: SOT-23-3_L2.9-W1.3-P1.90-LS2.4-BR
XP101 = Вилка на плату прямая BH2-20 (DS1014-20SF1B-B) 20pin шаг 2.00мм: Manufacturer: CONNFLY; Contributor: jordanjin; Convert to PCB: yes; UniqueId: ggeb4d4aa9e3e8a36bb; ModelId: 3146b565e2734c7388c693d0a43641ce; Origin Footprint: CONN-TH_20P-P2.00_DS1014-20SF1B; Device: Вилка на плату прямая BH2-20 (DS1014-20SF1B-B) 20pin шаг 2.00мм; Symbol: Вилка на плату прямая BH2-20 (DS1014-20SF1B-B) 20pin шаг 2.00мм; Supplier: LCSC; Supplier Part: C7498721; Manufacturer Part: BH2-20 (DS1014-20SF1B-B); JLCPCB Part Class: Extended Part; spicePre: X; spiceSymbolName: Вилка на плату прямая BH2-20 (DS1014-20SF1B-B) 20pin шаг 2.00мм; Add into BOM: yes; FootprintName: CONN-TH_20P-P2.00_DS1014-20SF1B; ModelName: CONN-TH_20P-P2.00_DS1014-20SF1B
XP102 = Вилка на плату прямая BH2-20 (DS1014-20SF1B-B) 20pin шаг 2.00мм: Manufacturer: CONNFLY; Contributor: jordanjin; Convert to PCB: yes; UniqueId: ggea69bf68db1b85ec2; ModelId: 3146b565e2734c7388c693d0a43641ce; Origin Footprint: CONN-TH_20P-P2.00_DS1014-20SF1B; Device: Вилка на плату прямая BH2-20 (DS1014-20SF1B-B) 20pin шаг 2.00мм; Symbol: Вилка на плату прямая BH2-20 (DS1014-20SF1B-B) 20pin шаг 2.00мм; Supplier: LCSC; Supplier Part: C7498721; Manufacturer Part: BH2-20 (DS1014-20SF1B-B); JLCPCB Part Class: Extended Part; spicePre: X; spiceSymbolName: Вилка на плату прямая BH2-20 (DS1014-20SF1B-B) 20pin шаг 2.00мм; Add into BOM: yes; FootprintName: CONN-TH_20P-P2.00_DS1014-20SF1B; ModelName: CONN-TH_20P-P2.00_DS1014-20SF1B
XP103 = Вилка на плату прямая BH-10 (DS1013-10S) 10pin шаг 2.54мм: Manufacturer: CONNFLY; Manufacturer Part: DS1013-10SSiB1-B-0; Contributor: jordanjin; Convert to PCB: yes; UniqueId: gge076e298fc8fb1dc6; ModelId: 803ffb6ab3ed4cb6af6e6de489a37367; Origin Footprint: IDC-TH_10P-P2.54-V-R2-C5-S2.54; Device: Вилка на плату прямая BH-10 (DS1013-10S) 10pin шаг 2.54мм; Symbol: Вилка на плату прямая BH-10 (DS1013-10S) 10pin шаг 2.54мм; Supplier: LCSC; JLCPCB Part Class: Extended Part; spicePre: X; spiceSymbolName: Вилка на плату прямая BH-10 (DS1013-10S) 10pin шаг 2.54мм; Add into BOM: yes; FootprintName: IDC-TH_10P-P2.54-V-R2-C5-S2.54; ModelName: IDC-TH_10P-P2.54-V-R2-C5-S2.54